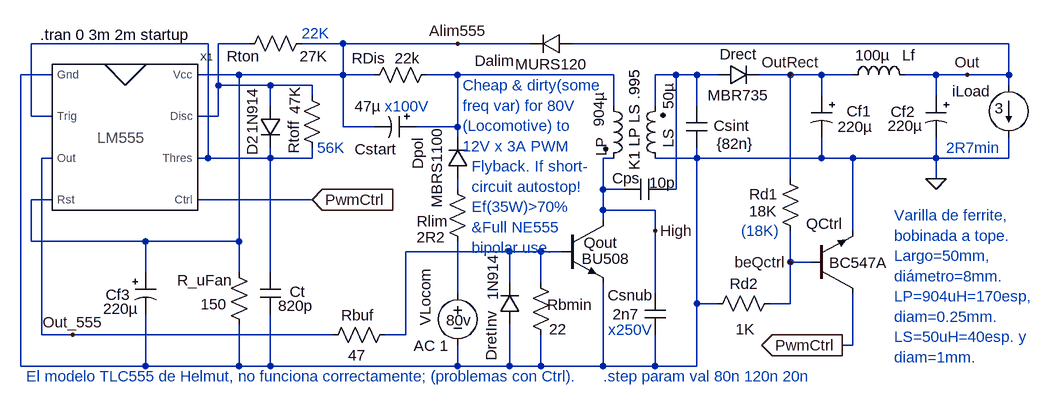
[diagram p0: schematic TeroJerLm555.asc]
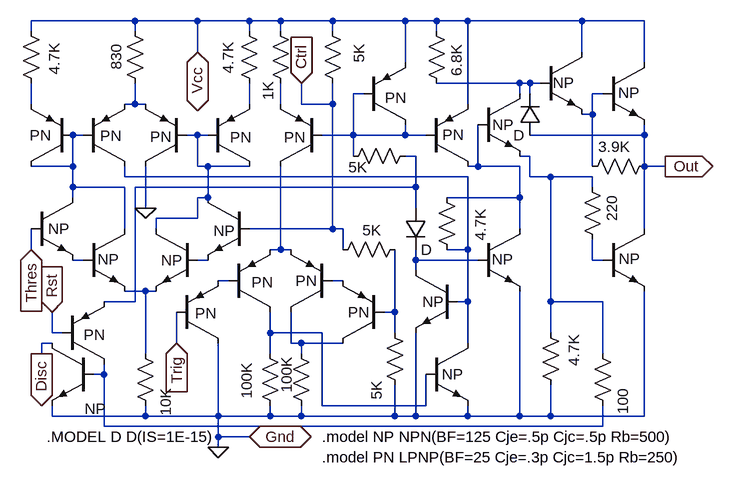
[diagram p1: sub-circuit lm555.asc]
TeroJerLm555.asc, the LTspice schematic file:
Version 4
SHEET 1 880 680
WIRE -2064 240 -2064 -208
WIRE -2048 -144 -2048 -256
WIRE -2048 48 -2048 -16
WIRE -2032 192 -2032 -80
WIRE -2016 -208 -2064 -208
WIRE -2016 -144 -2048 -144
WIRE -2016 -80 -2032 -80
WIRE -2016 -16 -2048 -16
WIRE -1984 192 -2032 192
WIRE -1872 48 -2048 48
WIRE -1872 96 -1872 48
WIRE -1872 240 -2064 240
WIRE -1872 240 -1872 160
WIRE -1776 -256 -2048 -256
WIRE -1776 -80 -1792 -80
WIRE -1776 -80 -1776 -256
WIRE -1760 -192 -1760 -256
WIRE -1760 -144 -1792 -144
WIRE -1760 -144 -1760 -192
WIRE -1728 -208 -1792 -208
WIRE -1728 48 -1872 48
WIRE -1728 48 -1728 -208
WIRE -1728 96 -1728 48
WIRE -1728 240 -1872 240
WIRE -1728 240 -1728 176
WIRE -1712 -256 -1760 -256
WIRE -1680 -192 -1760 -192
WIRE -1680 -160 -1680 -192
WIRE -1680 -80 -1776 -80
WIRE -1680 -80 -1680 -96
WIRE -1680 96 -1680 -80
WIRE -1680 240 -1728 240
WIRE -1680 240 -1680 160
WIRE -1616 -192 -1680 -192
WIRE -1616 -176 -1616 -192
WIRE -1616 -80 -1680 -80
WIRE -1616 -80 -1616 -96
WIRE -1616 -16 -1792 -16
WIRE -1584 192 -1984 192
WIRE -1568 -256 -1632 -256
WIRE -1568 -208 -1728 -208
WIRE -1568 -208 -1568 -256
WIRE -1568 -128 -1568 -208
WIRE -1520 -208 -1568 -208
WIRE -1520 -128 -1568 -128
WIRE -1472 192 -1504 192
WIRE -1472 192 -1472 64
WIRE -1392 -256 -1568 -256
WIRE -1392 -208 -1440 -208
WIRE -1392 -128 -1456 -128
WIRE -1392 -128 -1392 -208
WIRE -1392 -112 -1392 -128
WIRE -1392 -32 -1392 -48
WIRE -1392 128 -1392 48
WIRE -1392 240 -1680 240
WIRE -1392 240 -1392 208
WIRE -1312 64 -1472 64
WIRE -1312 112 -1312 64
WIRE -1312 240 -1392 240
WIRE -1312 240 -1312 176
WIRE -1280 -256 -1392 -256
WIRE -1264 64 -1312 64
WIRE -1264 112 -1264 64
WIRE -1264 240 -1312 240
WIRE -1264 240 -1264 192
WIRE -1232 64 -1264 64
WIRE -1168 -32 -1168 -80
WIRE -1168 0 -1168 -32
WIRE -1168 16 -1168 0
WIRE -1168 240 -1264 240
WIRE -1168 240 -1168 112
WIRE -1152 -208 -1392 -208
WIRE -1152 -160 -1152 -208
WIRE -1152 -80 -1168 -80
WIRE -1136 -32 -1168 -32
WIRE -1088 -160 -1088 -208
WIRE -1088 0 -1168 0
WIRE -1088 32 -1088 0
WIRE -1088 128 -1088 32
WIRE -1088 240 -1168 240
WIRE -1088 240 -1088 192
WIRE -1056 -208 -1088 -208
WIRE -1056 -32 -1072 -32
WIRE -1056 -32 -1056 -208
WIRE -1024 -208 -1056 -208
WIRE -1024 -160 -1024 -208
WIRE -1024 -80 -1088 -80
WIRE -1024 -80 -1024 -96
WIRE -1024 144 -1024 -80
WIRE -1024 240 -1088 240
WIRE -1024 240 -1024 144
WIRE -992 -208 -1024 -208
WIRE -992 144 -1024 144
WIRE -880 -208 -928 -208
WIRE -880 -48 -880 -208
WIRE -880 80 -880 32
WIRE -880 144 -912 144
WIRE -880 144 -880 80
WIRE -848 80 -880 80
WIRE -832 -208 -880 -208
WIRE -832 -176 -832 -208
WIRE -832 -80 -1024 -80
WIRE -832 -80 -832 -112
WIRE -784 -208 -832 -208
WIRE -784 -80 -832 -80
WIRE -784 32 -784 -80
WIRE -784 208 -800 208
WIRE -784 208 -784 128
WIRE -656 -208 -704 -208
WIRE -656 -176 -656 -208
WIRE -656 -80 -784 -80
WIRE -656 -80 -656 -112
WIRE -656 -48 -656 -80
WIRE -608 -208 -656 -208
WIRE -544 -256 -1216 -256
WIRE -544 -208 -608 -208
WIRE -544 -208 -544 -256
WIRE -544 -192 -544 -208
WIRE -544 -80 -656 -80
WIRE -544 -80 -544 -112
FLAG -608 -208 Out
FLAG -1984 192 Out_555
FLAG -1088 32 High
FLAG -880 -208 OutRect
FLAG -1616 -16 PwmCtrl
IOPIN -1616 -16 In
FLAG -880 80 beQctrl
FLAG -1392 -256 Alim555
FLAG -800 208 PwmCtrl
IOPIN -800 208 Out
FLAG -656 -48 0
SYMBOL cap -1696 96 R0
WINDOW 0 70 30 Right 0
WINDOW 3 82 51 Right 0
SYMATTR InstName Ct
SYMATTR Value 820p
SYMBOL diode -1296 176 R180
WINDOW 0 44 -56 VRight 0
WINDOW 3 42 37 VRight 0
SYMATTR InstName DretInv
SYMATTR Value 1N914
SYMBOL diode -1216 -272 R90
WINDOW 0 58 119 VBottom 0
WINDOW 3 32 32 VTop 0
SYMATTR InstName Dalim
SYMATTR Value MURS120
SYMBOL diode -1408 -48 M180
WINDOW 0 -45 64 VLeft 0
WINDOW 3 -16 78 VLeft 0
SYMATTR InstName Dpol
SYMATTR Value MBRS1100
SYMBOL res -1600 -80 R180
WINDOW 0 28 32 VTop 0
WINDOW 3 27 88 VTop 0
SYMATTR InstName Rtoff
SYMATTR Value 47K
SYMATTR SpiceLine tol=1 pwr=0.1
SYMBOL res -1616 -272 R90
WINDOW 0 35 80 VRight 0
WINDOW 3 35 -24 VRight 0
SYMATTR InstName Rton
SYMATTR Value 27K
SYMATTR SpiceLine tol=1 pwr=0.1
SYMBOL npn -848 128 M180
WINDOW 0 -8 107 Left 0
WINDOW 3 28 47 Left 0
SYMATTR InstName QCtrl
SYMATTR Value BC547A
SYMBOL res -896 128 R90
WINDOW 0 -15 33 VRight 0
WINDOW 3 55 39 VRight 0
SYMATTR InstName Rd2
SYMATTR Value 1K
SYMATTR SpiceLine tol=1 pwr=0.1
SYMBOL voltage -1392 112 M0
WINDOW 0 34 22 VTop 0
WINDOW 3 -2 73 Bottom 0
WINDOW 123 41 81 Top 0
SYMATTR InstName VLocom
SYMATTR Value 80v
SYMATTR Value2 AC 1
SYMATTR SpiceLine Rser=1m
SYMBOL res -1424 -224 R90
WINDOW 0 -25 105 VTop 0
WINDOW 3 -25 45 VTop 0
SYMATTR InstName RDis
SYMATTR Value 22k
SYMATTR SpiceLine tol=10 pwr=5
SYMBOL res -1744 80 R0
WINDOW 0 7 28 Right 0
WINDOW 3 -3 65 Right 0
SYMATTR InstName R_uFan
SYMATTR Value 150
SYMATTR SpiceLine tol=1 pwr=0.1
SYMBOL res -1488 176 R90
WINDOW 0 -14 32 VRight 0
WINDOW 3 47 45 VRight 0
SYMATTR InstName Rbuf
SYMATTR Value 47
SYMATTR SpiceLine tol=1 pwr=0.1
SYMBOL res -1280 96 R0
WINDOW 0 96 50 Right 0
WINDOW 3 56 87 Right 0
SYMATTR InstName Rbmin
SYMATTR Value 22
SYMATTR SpiceLine tol=1 pwr=0.1
SYMBOL polcap -816 -176 M0
WINDOW 3 -9 48 Right 0
WINDOW 0 -23 24 Right 0
SYMATTR Value 220µ
SYMATTR InstName Cf1
SYMATTR Description Capacitor
SYMATTR Type cap
SYMATTR SpiceLine V=16 Irms=2.4 Rser=0.05 MTBF=0 Lser=2.1p ppPkg=1
SYMBOL polcap -640 -176 M0
WINDOW 3 90 46 Right 0
WINDOW 0 86 25 Right 0
SYMATTR Value 220µ
SYMATTR InstName Cf2
SYMATTR Description Capacitor
SYMATTR Type cap
SYMATTR SpiceLine V=16 Irms=2.4 Rser=0.05 MTBF=0 Lser=2.1p ppPkg=1
SYMBOL ind -688 -192 M270
WINDOW 0 62 10 VBottom 0
WINDOW 3 62 65 VBottom 0
SYMATTR InstName Lf
SYMATTR Value 100µ
SYMATTR SpiceLine Ipk=10 Rser=0.001 Rpar=0 Cpar=0
SYMBOL polcap -1456 -144 R90
WINDOW 0 35 62 VTop 0
WINDOW 3 -31 74 VTop 0
SYMATTR InstName Cstart
SYMATTR Value 47µ
SYMATTR Description Capacitor
SYMATTR Type cap
SYMATTR SpiceLine V=100 Irms=210m Rser=0.37 MTBF=2000 Lser=0 mfg="Nichicon" pn="UPR2A470MPH" type="Al electrolytic" ppPkg=1
SYMBOL cap -1104 128 R0
WINDOW 0 13 3 Right 0
WINDOW 3 -9 32 Right 0
SYMATTR InstName Csnub
SYMATTR Value 2n7
SYMATTR SpiceLine Rser=10
SYMBOL diode -1696 -160 R0
WINDOW 0 -12 46 VRight 0
WINDOW 3 -12 -28 VRight 0
SYMATTR InstName D2
SYMATTR Value 1N914
SYMBOL ind2 -1168 -176 R0
WINDOW 0 -3 64 VRight 0
WINDOW 3 -7 -6 VRight 0
SYMATTR InstName LP
SYMATTR Value 904µ
SYMATTR Type ind
SYMATTR SpiceLine Rser=1 Rpar=1430 Cpar=5p
SYMBOL ind2 -1072 -64 R180
WINDOW 0 -4 32 VRight 0
WINDOW 3 -4 91 VRight 0
SYMATTR InstName LS
SYMATTR Value 50µ
SYMATTR Type ind
SYMATTR SpiceLine Rser=0.01 Rpar=110
SYMBOL diode -992 -192 R270
WINDOW 0 32 32 VTop 0
WINDOW 3 0 32 VBottom 0
SYMATTR InstName Drect
SYMATTR Value MBR735
SYMBOL npn3 -1232 16 R0
WINDOW 3 31 59 Left 0
WINDOW 0 34 34 Left 0
SYMATTR Value BU508
SYMATTR InstName Qout
SYMBOL cap -1040 -160 R0
WINDOW 0 97 30 Right 0
WINDOW 3 104 58 Right 0
SYMATTR InstName Csint
SYMATTR Value {82n}
SYMBOL res -864 48 R180
WINDOW 0 79 72 Right 0
WINDOW 3 79 46 Right 0
SYMATTR InstName Rd1
SYMATTR Value 18K
SYMATTR SpiceLine tol=1 pwr=0.1
SYMBOL res -1408 -48 R0
WINDOW 0 -47 65 Left 0
WINDOW 3 -47 90 Left 0
SYMATTR InstName Rlim
SYMATTR Value 2R2
SYMATTR SpiceLine tol=1 pwr=0.1
SYMBOL cap -1072 -48 R90
WINDOW 0 15 61 VBottom 0
WINDOW 3 -10 5 VTop 0
SYMATTR InstName Cps
SYMATTR Value 10p
SYMBOL polcap -1888 96 R0
WINDOW 3 5 56 Right 0
WINDOW 0 -8 34 Right 0
SYMATTR Value 220µ
SYMATTR InstName Cf3
SYMATTR Description Capacitor
SYMATTR Type cap
SYMATTR SpiceLine V=16 Irms=2.4 Rser=0.05 MTBF=0 Lser=2.1p ppPkg=1
SYMBOL current -544 -192 R0
WINDOW 0 -87 9 Left 0
WINDOW 3 -22 35 Left 0
WINDOW 123 0 0 Left 0
WINDOW 39 0 0 Left 0
SYMATTR InstName iLoad
SYMATTR Value 3
SYMBOL LM555 -1856 -96 R0
SYMATTR InstName X1
TEXT -1120 -216 VRight 0 !K1 LP LS .995
TEXT -2034 -270 Left 0 !.tran 0 3m 2m startup
TEXT -896 32 Right 0 ;(18K)
TEXT -1504 -160 Left 0 ;x100V
TEXT -1160 184 Left 0 ;x250V
TEXT -640 -96 Left 0 ;2R7min
TEXT -720 8 Left 0 ;Varilla de ferrite,\nbobinada a tope.\nLargo=50mm,\ndiámetro=8mm.\nLP=904uH=170esp,\ndiam=0.25mm.\nLS=50uH=40esp. y\ndiam=1mm.
TEXT -1384 -192 Left 0 ;Cheap & dirty(some\nfreq var) for 80V\n(Locomotive) to\n12V x 3A PWM\n  Flyback. If short-\n  circuit autostop!\n  Ef(35W)>70%\n  &Full NE555\n  bipolar use.
TEXT -2056 256 Left 0 ;El modelo TLC555 de Helmut, no funciona correctamente; (problemas con Ctrl).
TEXT -1168 256 Left 0 ;.step param val 80n 120n 20n
TEXT -1608 -96 Left 0 ;56K
TEXT -1632 -272 Left 0 ;22K

lm555.asc, the sub-circuit schematic file:
Version 4
SHEET 1 984 680
WIRE -96 -64 -96 -80
WIRE -96 48 -96 16
WIRE -96 272 -96 240
WIRE -80 432 -80 416
WIRE -64 400 -64 368
WIRE -64 416 -80 416
WIRE -64 528 -64 512
WIRE -48 400 -64 400
WIRE -32 144 -96 144
WIRE -32 144 -32 96
WIRE -32 176 -32 144
WIRE -32 192 -32 176
WIRE -16 96 -32 96
WIRE -16 288 -32 288
WIRE 16 464 0 464
WIRE 16 464 16 448
WIRE 16 544 16 464
WIRE 48 160 48 144
WIRE 48 176 -32 176
WIRE 48 240 48 176
WIRE 64 -80 -96 -80
WIRE 64 -64 64 -80
WIRE 64 48 48 48
WIRE 64 48 64 16
WIRE 64 352 16 352
WIRE 64 352 64 176
WIRE 80 48 64 48
WIRE 80 208 80 144
WIRE 80 336 48 336
WIRE 80 432 80 336
WIRE 80 528 -64 528
WIRE 80 528 80 512
WIRE 96 240 96 224
WIRE 96 336 80 336
WIRE 128 416 128 368
WIRE 160 -80 64 -80
WIRE 160 -32 160 -80
WIRE 160 96 144 96
WIRE 160 144 160 96
WIRE 160 224 96 224
WIRE 160 224 160 192
WIRE 176 96 160 96
WIRE 176 144 160 144
WIRE 176 192 160 192
WIRE 176 192 176 144
WIRE 176 288 160 288
WIRE 192 528 80 528
WIRE 192 528 192 416
WIRE 192 560 192 528
WIRE 192 576 192 560
WIRE 208 320 192 320
WIRE 240 -80 160 -80
WIRE 240 -64 240 -80
WIRE 240 48 240 16
WIRE 240 144 176 144
WIRE 240 560 192 560
WIRE 272 400 272 368
WIRE 272 432 272 400
WIRE 272 528 192 528
WIRE 272 528 272 512
WIRE 288 -80 240 -80
WIRE 288 -64 288 -80
WIRE 288 48 288 16
WIRE 288 272 272 272
WIRE 288 272 288 144
WIRE 304 272 288 272
WIRE 304 416 304 368
WIRE 320 48 320 16
WIRE 320 416 304 416
WIRE 320 432 320 416
WIRE 320 528 272 528
WIRE 320 528 320 512
WIRE 352 400 272 400
WIRE 352 512 352 400
WIRE 368 -80 288 -80
WIRE 368 -64 368 -80
WIRE 368 48 320 48
WIRE 368 48 368 16
WIRE 368 240 240 240
WIRE 368 240 368 48
WIRE 384 240 368 240
WIRE 384 272 384 240
WIRE 384 320 368 320
WIRE 384 416 320 416
WIRE 400 96 352 96
WIRE 400 96 400 32
WIRE 400 128 400 96
WIRE 416 32 400 32
WIRE 464 368 448 368
WIRE 464 368 464 272
WIRE 464 400 464 368
WIRE 464 528 320 528
WIRE 464 528 464 480
WIRE 480 -80 368 -80
WIRE 480 -16 480 -80
WIRE 480 96 400 96
WIRE 480 96 480 80
WIRE 496 128 480 128
WIRE 496 176 64 176
WIRE 496 176 496 128
WIRE 496 208 496 176
WIRE 496 288 496 272
WIRE 496 304 496 288
WIRE 496 528 464 528
WIRE 496 528 496 400
WIRE 512 96 480 96
WIRE 512 512 352 512
WIRE 512 512 512 464
WIRE 528 -80 480 -80
WIRE 528 -64 528 -80
WIRE 576 -80 528 -80
WIRE 576 48 576 -80
WIRE 576 160 48 160
WIRE 576 272 544 272
WIRE 576 272 576 160
WIRE 576 352 560 352
WIRE 576 352 576 272
WIRE 576 416 576 352
WIRE 576 528 496 528
WIRE 576 528 576 512
WIRE 592 144 576 144
WIRE 592 144 592 80
WIRE 592 288 496 288
WIRE 656 16 528 16
WIRE 656 32 656 16
WIRE 656 144 592 144
WIRE 656 192 544 192
WIRE 656 192 656 144
WIRE 656 240 656 192
WIRE 656 528 576 528
WIRE 656 528 656 336
WIRE 672 16 656 16
WIRE 672 32 672 16
WIRE 672 128 656 128
WIRE 672 160 672 128
WIRE 688 16 672 16
WIRE 704 160 672 160
WIRE 704 352 704 160
WIRE 704 400 704 352
WIRE 704 528 656 528
WIRE 704 528 704 480
WIRE 752 -80 576 -80
WIRE 752 -32 752 -80
WIRE 768 64 752 64
WIRE 768 64 768 32
WIRE 768 144 768 64
WIRE 768 160 704 160
WIRE 768 176 768 160
WIRE 768 288 768 256
WIRE 784 32 768 32
WIRE 784 288 768 288
WIRE 784 352 704 352
WIRE 784 432 784 352
WIRE 784 544 16 544
WIRE 784 544 784 512
WIRE 848 -80 752 -80
WIRE 848 -16 848 -80
WIRE 848 96 672 96
WIRE 848 96 848 80
WIRE 848 144 848 96
WIRE 848 240 848 144
WIRE 848 528 704 528
WIRE 848 528 848 336
WIRE 880 144 848 144
FLAG 80 208 0
FLAG 192 576 0
FLAG 240 560 Gnd
IOPIN 240 560 BiDir
FLAG 128 416 Trig
IOPIN 128 416 In
FLAG 880 144 Out
IOPIN 880 144 Out
FLAG -64 368 Rst
IOPIN -64 368 In
FLAG 320 16 Ctrl
IOPIN 320 16 In
FLAG -96 272 Thres
IOPIN -96 272 In
FLAG -80 432 Disc
IOPIN -80 432 Out
FLAG 160 -32 Vcc
IOPIN 160 -32 BiDir
SYMBOL npn2 240 192 M0
WINDOW 0 56 32 Invisible 0
WINDOW 3 22 51 Left 0
SYMATTR InstName Q1
SYMATTR Value NP
SYMBOL npn2 -96 192 R0
WINDOW 0 56 32 Invisible 0
WINDOW 3 26 48 Left 0
SYMATTR InstName Q2
SYMATTR Value NP
SYMBOL npn2 -16 240 R0
WINDOW 0 56 32 Invisible 0
WINDOW 3 22 47 Left 0
SYMATTR InstName Q3
SYMATTR Value NP
SYMBOL npn2 160 240 M0
WINDOW 0 56 32 Invisible 0
WINDOW 3 23 48 Left 0
SYMATTR InstName Q4
SYMATTR Value NP
SYMBOL npn2 0 416 M0
WINDOW 0 56 32 Invisible 0
WINDOW 3 -19 101 Left 0
SYMATTR InstName Q5
SYMATTR Value NP
SYMBOL npn2 512 416 R0
WINDOW 0 56 32 Invisible 0
WINDOW 3 24 48 Left 0
SYMATTR InstName Q6
SYMATTR Value NP
SYMBOL pnp2 -32 144 R180
WINDOW 0 84 32 Invisible 0
WINDOW 3 33 48 Left 0
SYMATTR InstName Q7
SYMATTR Value PN
SYMBOL pnp2 -16 144 M180
WINDOW 0 84 32 Invisible 0
WINDOW 3 26 47 Left 0
SYMATTR InstName Q8
SYMATTR Value PN
SYMBOL pnp2 144 144 R180
WINDOW 0 84 32 Invisible 0
WINDOW 3 24 46 Left 0
SYMATTR InstName Q9
SYMATTR Value PN
SYMBOL pnp2 176 144 M180
WINDOW 0 84 32 Invisible 0
WINDOW 3 117 45 Left 0
SYMATTR InstName Q10
SYMATTR Value PN
SYMBOL pnp2 352 144 R180
WINDOW 0 84 32 Invisible 0
WINDOW 3 109 45 Left 0
SYMATTR InstName Q11
SYMATTR Value PN
SYMBOL res -112 -80 R0
WINDOW 0 36 40 Invisible 0
WINDOW 3 52 34 VRight 0
SYMATTR InstName R1
SYMATTR Value 4.7K
SYMATTR SpiceLine tol=1 pwr=0.1
SYMBOL res 48 -80 R0
WINDOW 0 36 40 Invisible 0
WINDOW 3 -13 35 VRight 0
SYMATTR InstName R2
SYMATTR Value 830
SYMATTR SpiceLine tol=1 pwr=0.1
SYMBOL res 224 -80 R0
WINDOW 0 36 40 Invisible 0
WINDOW 3 -17 32 VRight 0
SYMATTR InstName R3
SYMATTR Value 4.7K
SYMATTR SpiceLine tol=1 pwr=0.1
SYMBOL res 272 -80 R0
WINDOW 0 36 40 Invisible 0
WINDOW 3 -3 93 VRight 0
SYMATTR InstName R4
SYMATTR Value 1K
SYMATTR SpiceLine tol=1 pwr=0.1
SYMBOL res 352 -80 R0
WINDOW 0 36 40 Invisible 0
WINDOW 3 57 35 VRight 0
SYMATTR InstName R5
SYMATTR Value 5K
SYMATTR SpiceLine tol=1 pwr=0.1
SYMBOL res 512 -80 R0
WINDOW 0 36 40 Invisible 0
WINDOW 3 47 36 VRight 0
SYMATTR InstName R6
SYMATTR Value 6.8K
SYMATTR SpiceLine tol=1 pwr=0.1
SYMBOL pnp2 128 416 M180
WINDOW 0 84 32 Invisible 0
WINDOW 3 28 46 Left 0
SYMATTR InstName Q13
SYMATTR Value PN
SYMBOL pnp2 208 368 M180
WINDOW 0 84 32 Invisible 0
WINDOW 3 35 46 Left 0
SYMATTR InstName Q14
SYMATTR Value PN
SYMBOL pnp2 368 368 R180
WINDOW 0 84 32 Invisible 0
WINDOW 3 24 48 Left 0
SYMATTR InstName Q15
SYMATTR Value PN
SYMBOL pnp2 448 416 R180
WINDOW 0 84 32 Invisible 0
WINDOW 3 23 48 Left 0
SYMATTR InstName Q16
SYMATTR Value PN
SYMBOL res 256 416 R0
WINDOW 0 36 40 Invisible 0
WINDOW 3 -20 29 VRight 0
SYMATTR InstName R7
SYMATTR Value 100K
SYMATTR SpiceLine tol=1 pwr=0.1
SYMBOL res 304 416 R0
WINDOW 0 36 40 Invisible 0
WINDOW 3 -7 20 VRight 0
SYMATTR InstName R8
SYMATTR Value 100K
SYMATTR SpiceLine tol=1 pwr=0.1
SYMBOL res 480 256 R90
WINDOW 0 36 40 Invisible 0
WINDOW 3 -14 37 VRight 0
SYMATTR InstName R9
SYMATTR Value 5K
SYMATTR SpiceLine tol=1 pwr=0.1
SYMBOL res 448 384 R0
WINDOW 0 36 40 Invisible 0
WINDOW 3 -12 90 VRight 0
SYMATTR InstName R10
SYMATTR Value 5K
SYMATTR SpiceLine tol=1 pwr=0.1
SYMBOL res 64 416 R0
WINDOW 0 36 40 Invisible 0
WINDOW 3 47 69 VRight 0
SYMATTR InstName R11
SYMATTR Value 10K
SYMATTR SpiceLine tol=1 pwr=0.1
SYMBOL pnp2 -48 448 M180
WINDOW 0 84 32 Invisible 0
WINDOW 3 33 45 Left 0
SYMATTR InstName Q17
SYMATTR Value PN
SYMBOL npn2 560 304 M0
WINDOW 0 56 32 Invisible 0
WINDOW 3 21 48 Left 0
SYMATTR InstName Q18
SYMATTR Value NP
SYMBOL res 496 112 R90
WINDOW 0 36 40 Invisible 0
WINDOW 3 33 74 VRight 0
SYMATTR InstName R12
SYMATTR Value 5K
SYMATTR SpiceLine tol=1 pwr=0.1
SYMBOL pnp2 416 80 M180
WINDOW 0 84 32 Invisible 0
WINDOW 3 33 42 Left 0
SYMATTR InstName Q19
SYMATTR Value PN
SYMBOL pnp2 512 144 M180
WINDOW 0 84 32 Invisible 0
WINDOW 3 25 49 Left 0
SYMATTR InstName Q20
SYMATTR Value PN
SYMBOL npn2 592 240 R0
WINDOW 0 56 32 Invisible 0
WINDOW 3 21 47 Left 0
SYMATTR InstName Q21
SYMATTR Value NP
SYMBOL res 560 288 R180
WINDOW 0 36 40 Invisible 0
WINDOW 3 -36 29 VRight 0
SYMATTR InstName R13
SYMATTR Value 4.7K
SYMATTR SpiceLine tol=1 pwr=0.1
SYMBOL npn2 688 -32 R0
WINDOW 0 56 32 Invisible 0
WINDOW 3 19 47 Left 0
SYMATTR InstName Q22
SYMATTR Value NP
SYMBOL npn2 592 32 R0
WINDOW 0 56 32 Invisible 0
WINDOW 3 22 48 Left 0
SYMATTR InstName Q23
SYMATTR Value NP
SYMBOL npn2 784 -16 R0
WINDOW 0 56 32 Invisible 0
WINDOW 3 24 47 Left 0
SYMATTR InstName Q24
SYMATTR Value NP
SYMBOL res 864 128 R90
WINDOW 0 36 40 Invisible 0
WINDOW 3 -14 37 VRight 0
SYMATTR InstName R14
SYMATTR Value 3.9K
SYMATTR SpiceLine tol=1 pwr=0.1
SYMBOL npn2 784 240 R0
WINDOW 0 56 32 Invisible 0
WINDOW 3 25 46 Left 0
SYMATTR InstName Q25
SYMATTR Value NP
SYMBOL res 784 272 R180
WINDOW 0 36 40 Invisible 0
WINDOW 3 -14 43 VRight 0
SYMATTR InstName R15
SYMATTR Value 220
SYMATTR SpiceLine tol=1 pwr=0.1
SYMBOL res 720 496 R180
WINDOW 0 36 40 Invisible 0
WINDOW 3 -20 44 VRight 0
SYMATTR InstName R16
SYMATTR Value 4.7K
SYMATTR SpiceLine tol=1 pwr=0.1
SYMBOL res 768 416 R0
WINDOW 0 36 40 Invisible 0
WINDOW 3 47 69 VRight 0
SYMATTR InstName R17
SYMATTR Value 100
SYMATTR SpiceLine tol=1 pwr=0.1
SYMBOL diode 688 96 R180
WINDOW 0 24 72 Invisible 0
WINDOW 3 24 0 Left 0
SYMATTR InstName D2
SYMBOL diode 480 208 R0
WINDOW 0 24 0 Invisible 0
SYMATTR InstName D1
TEXT 352 560 Left 0 !.model NP NPN(BF=125 Cje=.5p Cjc=.5p Rb=500)\n.model PN LPNP(BF=25 Cje=.3p Cjc=1.5p Rb=250)
TEXT -72 560 Left 0 !.MODEL D D(IS=1E-15)

The netlist it stands for:
* TeroJerLm555.asc
Ct N001 0 820p
DretInv 0 N003 1N914
Dalim Out Alim555 MURS120
Dpol N005 N004 MBRS1100
Rtoff N001 N002 47K tol=1 pwr=0.1
Rton Alim555 N002 27K tol=1 pwr=0.1
QCtrl PwmCtrl beQctrl 0 0 BC547A
Rd2 beQctrl 0 1K tol=1 pwr=0.1
VLocom N006 0 80v AC 1 Rser=1m
RDis N004 Alim555 22k tol=10 pwr=5
R_uFan Alim555 0 150 tol=1 pwr=0.1
Rbuf N003 Out_555 47 tol=1 pwr=0.1
Rbmin N003 0 22 tol=1 pwr=0.1
Cf1 OutRect 0 220µ V=16 Irms=2.4 Rser=0.05 MTBF=0 Lser=2.1p ppPkg=1
Cf2 Out 0 220µ V=16 Irms=2.4 Rser=0.05 MTBF=0 Lser=2.1p ppPkg=1
Lf Out OutRect 100µ Ipk=10 Rser=0.001 Rpar=0 Cpar=0
Cstart N004 Alim555 47µ V=100 Irms=210m Rser=0.37 MTBF=2000 Lser=0 mfg="Nichicon" pn="UPR2A470MPH" type="Al electrolytic" ppPkg=1
Csnub High 0 2n7 Rser=10
D2 N002 N001 1N914
LP N004 High 904µ Rser=1 Rpar=1430 Cpar=5p
LS 0 N007 50µ Rser=0.01 Rpar=110
Drect N007 OutRect MBR735
Qout High N003 0 0 BU508
Csint N007 0 {82n}
Rd1 beQctrl OutRect 18K tol=1 pwr=0.1
Rlim N005 N006 2R2 tol=1 pwr=0.1
Cps N007 High 10p
Cf3 Alim555 0 220µ V=16 Irms=2.4 Rser=0.05 MTBF=0 Lser=2.1p ppPkg=1
iLoad Out 0 3
XX1 0 N001 Out_555 Alim555 PwmCtrl N001 N002 Alim555 lm555

* block symbol definitions
.subckt lm555 Gnd Trig Out Rst Ctrl Thres Disc Vcc
Q1 N009 Ctrl N010 0 NP
Q2 N002 Thres N003 0 NP
Q3 N002 N003 N008 0 NP
Q4 N009 N010 N008 0 NP
Q5 Disc N004 0 0 NP
Q6 N005 N013 0 0 NP
Q7 N002 N002 N001 0 PN
Q8 N005 N002 N006 0 PN
Q9 0 N009 N006 0 PN
Q10 N009 N009 N012 0 PN
Q11 N015 N018 N014 0 PN
R1 Vcc N001 4.7K tol=1 pwr=0.1
R2 Vcc N006 830 tol=1 pwr=0.1
R3 Vcc N012 4.7K tol=1 pwr=0.1
R4 Vcc N014 1K tol=1 pwr=0.1
R5 Vcc Ctrl 5K tol=1 pwr=0.1
R6 Vcc N022 6.8K tol=1 pwr=0.1
Q13 0 Trig N011 0 PN
Q14 N013 N011 N015 0 PN
Q15 N016 N017 N015 0 PN
Q16 N016 N019 N017 0 PN
R7 N013 0 100K tol=1 pwr=0.1
R8 N016 0 100K tol=1 pwr=0.1
R9 N019 Ctrl 5K tol=1 pwr=0.1
R10 N019 0 5K tol=1 pwr=0.1
R11 N008 0 10K tol=1 pwr=0.1
Q17 N004 Rst N007 0 PN
Q18 N020 N005 0 0 NP
R12 N007 N018 5K tol=1 pwr=0.1
Q19 N018 N018 Vcc 0 PN
Q20 N021 N018 Vcc 0 PN
Q21 N021 N020 0 0 NP
R13 N005 N021 4.7K tol=1 pwr=0.1
Q22 Vcc N022 N024 0 NP
Q23 N022 N021 N023 0 NP
Q24 Vcc N024 Out 0 NP
R14 Out N024 3.9K tol=1 pwr=0.1
Q25 Out N025 0 0 NP
R15 N025 N023 220 tol=1 pwr=0.1
R16 0 N023 4.7K tol=1 pwr=0.1
R17 N023 N004 100 tol=1 pwr=0.1
D2 Out N022 D
D1 N007 N020 D
.model NP NPN(BF=125 Cje=.5p Cjc=.5p Rb=500)
.model PN LPNP(BF=25 Cje=.3p Cjc=1.5p Rb=250)
.MODEL D D(IS=1E-15)
.ends lm555

.model D D
.lib standard.dio
.model NPN NPN
.model PNP PNP
.lib standard.bjt
K1 LP LS .995
.tran 0 3m 2m startup
* (18K)
* x100V
* x250V
* 2R7min
* Varilla de ferrite,
* bobinada a tope.
* Largo=50mm,
* diámetro=8mm.
* LP=904uH=170esp,
* diam=0.25mm.
* LS=50uH=40esp. y
* diam=1mm.
* Cheap & dirty(some
* freq var) for 80V
* (Locomotive) to
* 12V x 3A PWM
*   Flyback. If short-
*   circuit autostop!
*   Ef(35W)>70%
*   &Full NE555
*   bipolar use.
* El modelo TLC555 de Helmut, no funciona correctamente; (problemas con Ctrl).
* .step param val 80n 120n 20n
* 56K
* 22K
.backanno
.end